# EAGLE design sch2 (EAGLE 7.4.0)
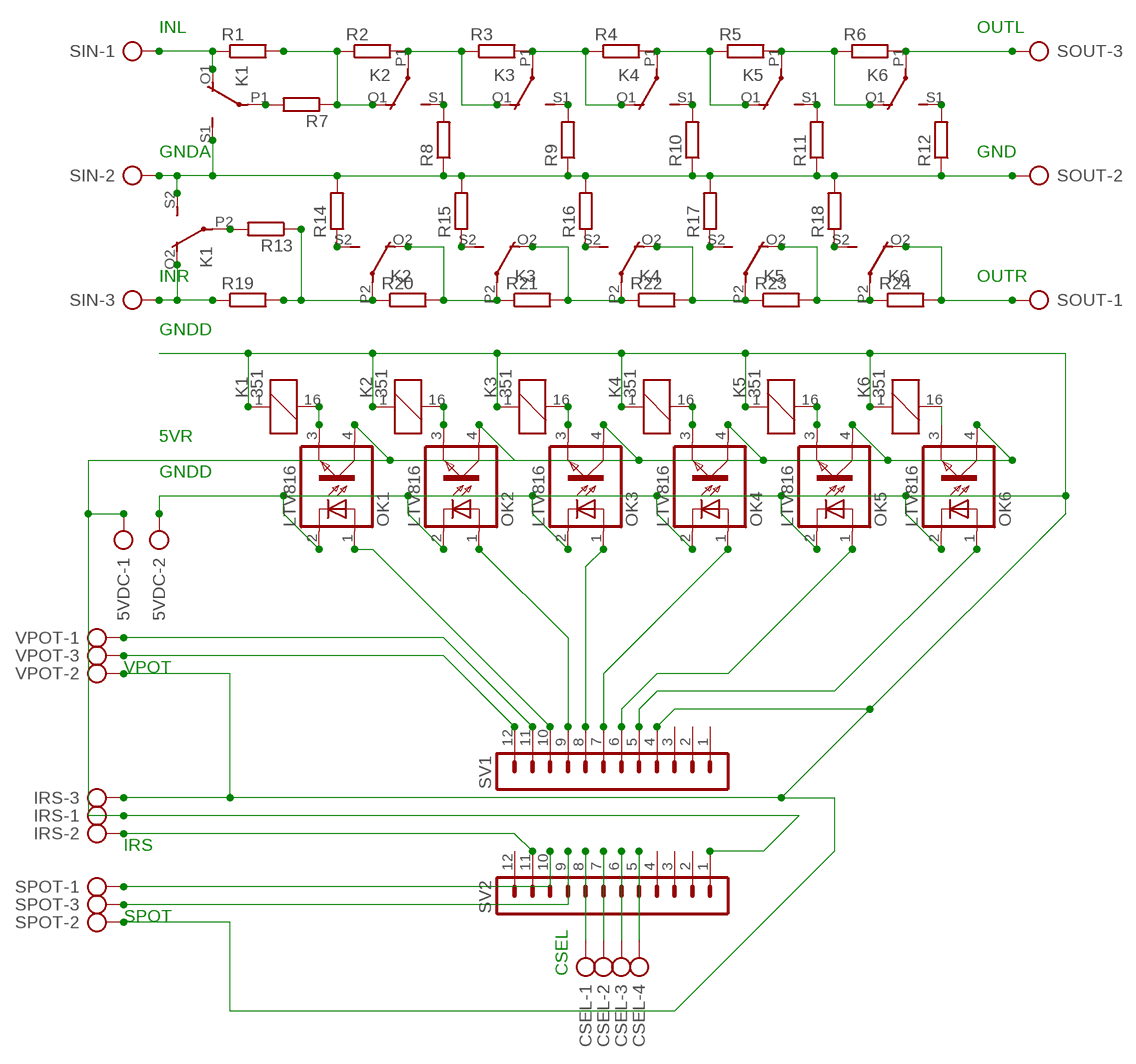
[diagram p0: schematic, sheet 1]

## Parts
5VDC  AK500/2  [AK500/2]
CSEL  AK500/4  [AK500/4]
IRS  AK500/3  [AK500/3]
K1  351  [351]
K2  351  [351]
K3  351  [351]
K4  351  [351]
K5  351  [351]
K6  351  [351]
OK1  LTV816  [DIL04]
OK2  LTV816  [DIL04]
OK3  LTV816  [DIL04]
OK4  LTV816  [DIL04]
OK5  LTV816  [DIL04]
OK6  LTV816  [DIL04]
R1  R-EU_0204/7  [0204/7]
R2  R-EU_0204/7  [0204/7]
R3  R-EU_0204/7  [0204/7]
R4  R-EU_0204/7  [0204/7]
R5  R-EU_0204/7  [0204/7]
R6  R-EU_0204/7  [0204/7]
R7  R-EU_0204/7  [0204/7]
R8  R-EU_0204/7  [0204/7]
R9  R-EU_0204/7  [0204/7]
R10  R-EU_0204/7  [0204/7]
R11  R-EU_0204/7  [0204/7]
R12  R-EU_0204/7  [0204/7]
R13  R-EU_0204/7  [0204/7]
R14  R-EU_0204/7  [0204/7]
R15  R-EU_0204/7  [0204/7]
R16  R-EU_0204/7  [0204/7]
R17  R-EU_0204/7  [0204/7]
R18  R-EU_0204/7  [0204/7]
R19  R-EU_0204/7  [0204/7]
R20  R-EU_0204/7  [0204/7]
R21  R-EU_0204/7  [0204/7]
R22  R-EU_0204/7  [0204/7]
R23  R-EU_0204/7  [0204/7]
R24  R-EU_0204/7  [0204/7]
SIN  AK500/3  [AK500/3]
SOUT  AK500/3  [AK500/3]
SPOT  AK500/3  [AK500/3]
SV1  MA12-1  [MA12-1]
SV2  MA12-1  [MA12-1]
VPOT  AK500/3  [AK500/3]

## Nets
GNDA: K1.S1(2:S) K1.S2(3:S) R8.1 R9.1 R10.1 R11.1 R12.1 R14.2 R15.2 R16.2 R17.2 R18.2 SIN.2 SOUT.2
GNDD: 5VDC.2 IRS.3 K1.1 K2.1 K3.1 K4.1 K5.1 K6.1 OK1.2(C) OK2.2(C) OK3.2(C) OK4.2(C) OK5.2(C) OK6.2(C) SPOT.2 SV1.4 VPOT.2
N$1: K2.O1(2:O) R1.2 R2.1 R7.1
N$2: K2.P1(2:P) K3.O1(2:O) R2.2 R3.1
N$3: K3.P1(2:P) K4.O1(2:O) R3.2 R4.1
N$4: K4.P1(2:P) K5.O1(2:O) R4.2 R5.1
N$5: K5.P1(2:P) K6.O1(2:O) R5.2 R6.1
N$6: K6.P1(2:P) R6.2 SOUT.3
N$7: K1.O1(2:O) R1.1 SIN.1
N$8: K1.P2(3:P) R13.2
N$9: K2.S1(2:S) R8.2
N$10: K3.S1(2:S) R9.2
N$11: K4.S1(2:S) R10.2
N$12: K5.S1(2:S) R11.2
N$13: K6.S1(2:S) R12.2
N$14: K1.P1(2:P) R7.2
N$15: K1.O2(3:O) R19.1 SIN.3
N$16: K2.S2(3:S) R14.1
N$17: K3.S2(3:S) R15.1
N$18: K4.S2(3:S) R16.1
N$19: K5.S2(3:S) R17.1
N$20: K6.S2(3:S) R18.1
N$21: SV1.11 VPOT.1
N$22: SV1.12 VPOT.3
N$23: K1.16 OK1.3(EMIT)
N$24: K2.16 OK2.3(EMIT)
N$25: K3.16 OK3.3(EMIT)
N$26: K4.16 OK4.3(EMIT)
N$27: K2.P2(3:P) R13.1 R19.2 R20.1
N$28: K2.O2(3:O) K3.P2(3:P) R20.2 R21.1
N$29: K3.O2(3:O) K4.P2(3:P) R21.2 R22.1
N$30: K4.O2(3:O) K5.P2(3:P) R22.2 R23.1
N$31: K5.O2(3:O) K6.P2(3:P) R23.2 R24.1
N$32: K6.O2(3:O) R24.2 SOUT.1
N$33: K5.16 OK5.3(EMIT)
N$34: K6.16 OK6.3(EMIT)
N$36: OK6.1(A) SV1.5
N$37: OK5.1(A) SV1.6
N$38: OK4.1(A) SV1.7
N$39: OK3.1(A) SV1.8
N$40: OK2.1(A) SV1.9
N$41: OK1.1(A) SV1.10
N$42: IRS.2 SV2.11
N$43: CSEL.1 SV2.8
N$44: CSEL.2 SV2.7
N$45: CSEL.3 SV2.6
N$46: CSEL.4 SV2.5
N$47: SPOT.1 SV2.10
N$48: SPOT.3 SV2.9
N$50: 5VDC.1 IRS.1 OK1.4(COL) OK2.4(COL) OK3.4(COL) OK4.4(COL) OK5.4(COL) OK6.4(COL) SV2.1
Unconnected: SV1.1 SV1.2 SV1.3 SV2.2 SV2.3 SV2.4 SV2.12

## Notes on the sheet
- INL | OUTL
- GNDA | GND
- INR | OUTR
- GNDD
- 5VR
- GNDD
- VPOT
- IRS
- SPOT
- CSEL

## Library data of the parts
5VDC = con-ptr500:AK500/2: CONNECTOR; OC_FARNELL: unknown; OC_NEWARK: unknown
CSEL = con-ptr500:AK500/4: CONNECTOR; OC_FARNELL: unknown; OC_NEWARK: unknown
IRS SIN SOUT SPOT VPOT = con-ptr500:AK500/3: CONNECTOR; OC_FARNELL: unknown; OC_NEWARK: unknown
K1-K6 = relay:351: RELAY 2 x switch, Omron; OC_FARNELL: unknown; OC_NEWARK: unknown
OK1-OK6 = optocoupler:LTV816: OPTO COUPLER Source: LITEON, LTV816.pdf; OC_FARNELL: unknown; OC_NEWARK: unknown
R1-R24 = rcl:R-EU_: RESISTOR, European symbol
SV1 SV2 = con-lstb:MA12-1: PIN HEADER; OC_FARNELL: unknown; OC_NEWARK: unknown

## Board
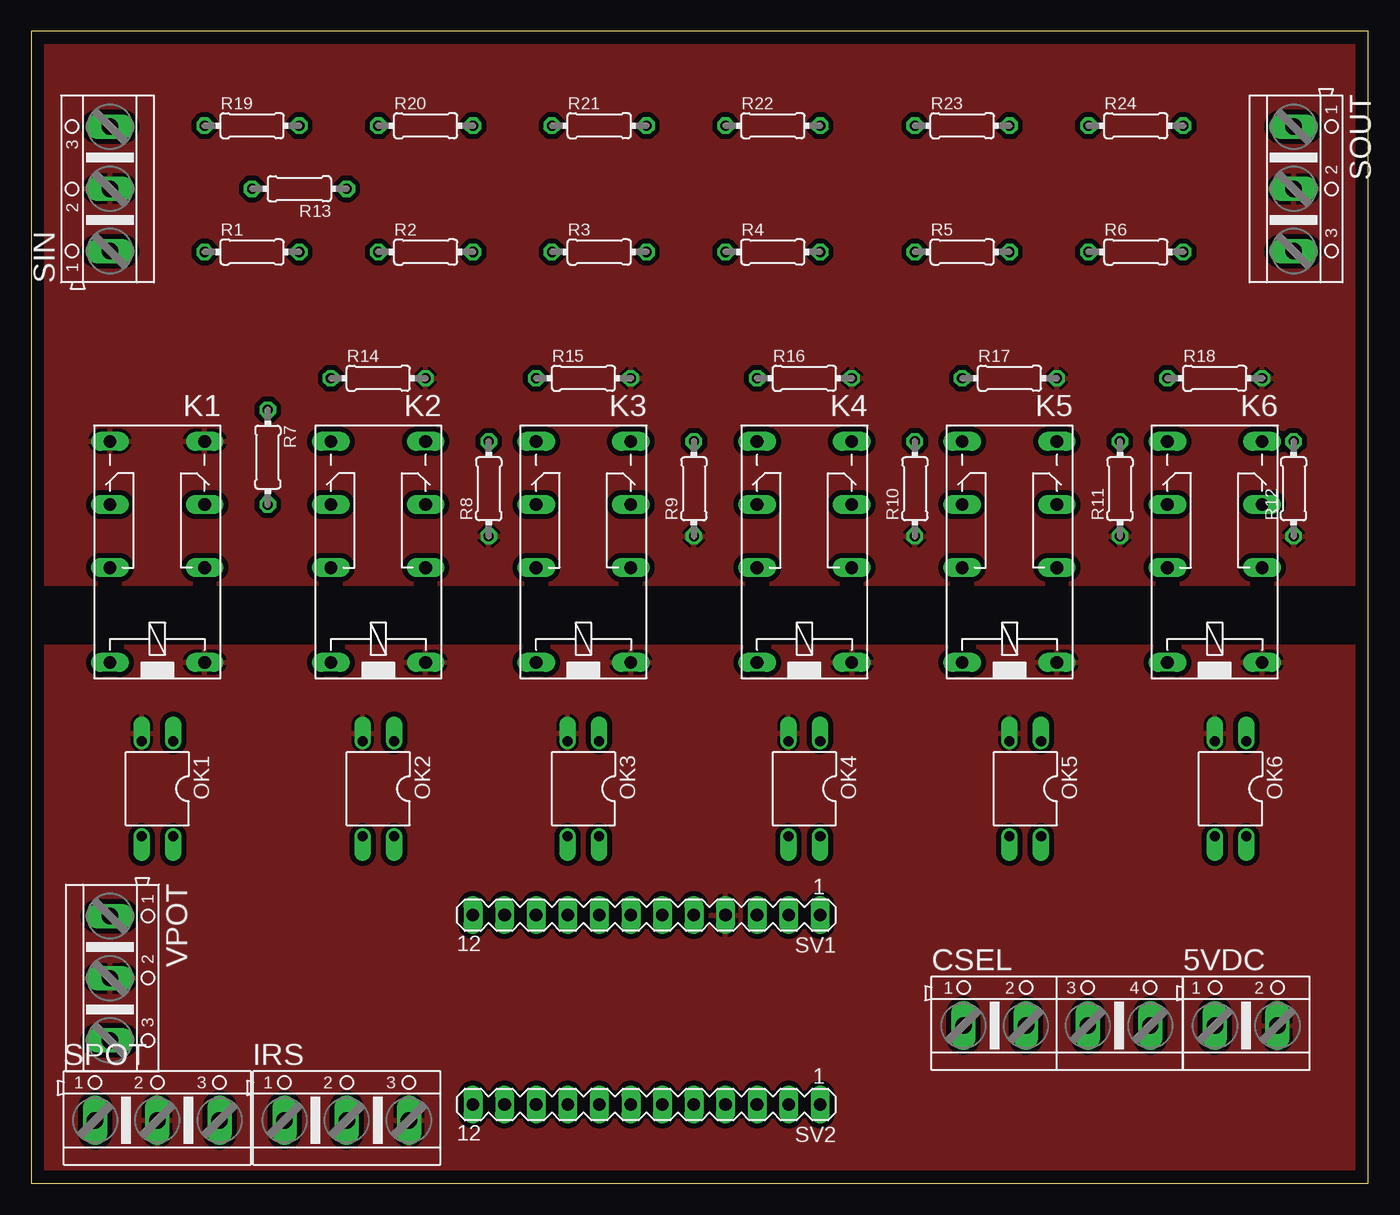
[diagram p1: board, top side]
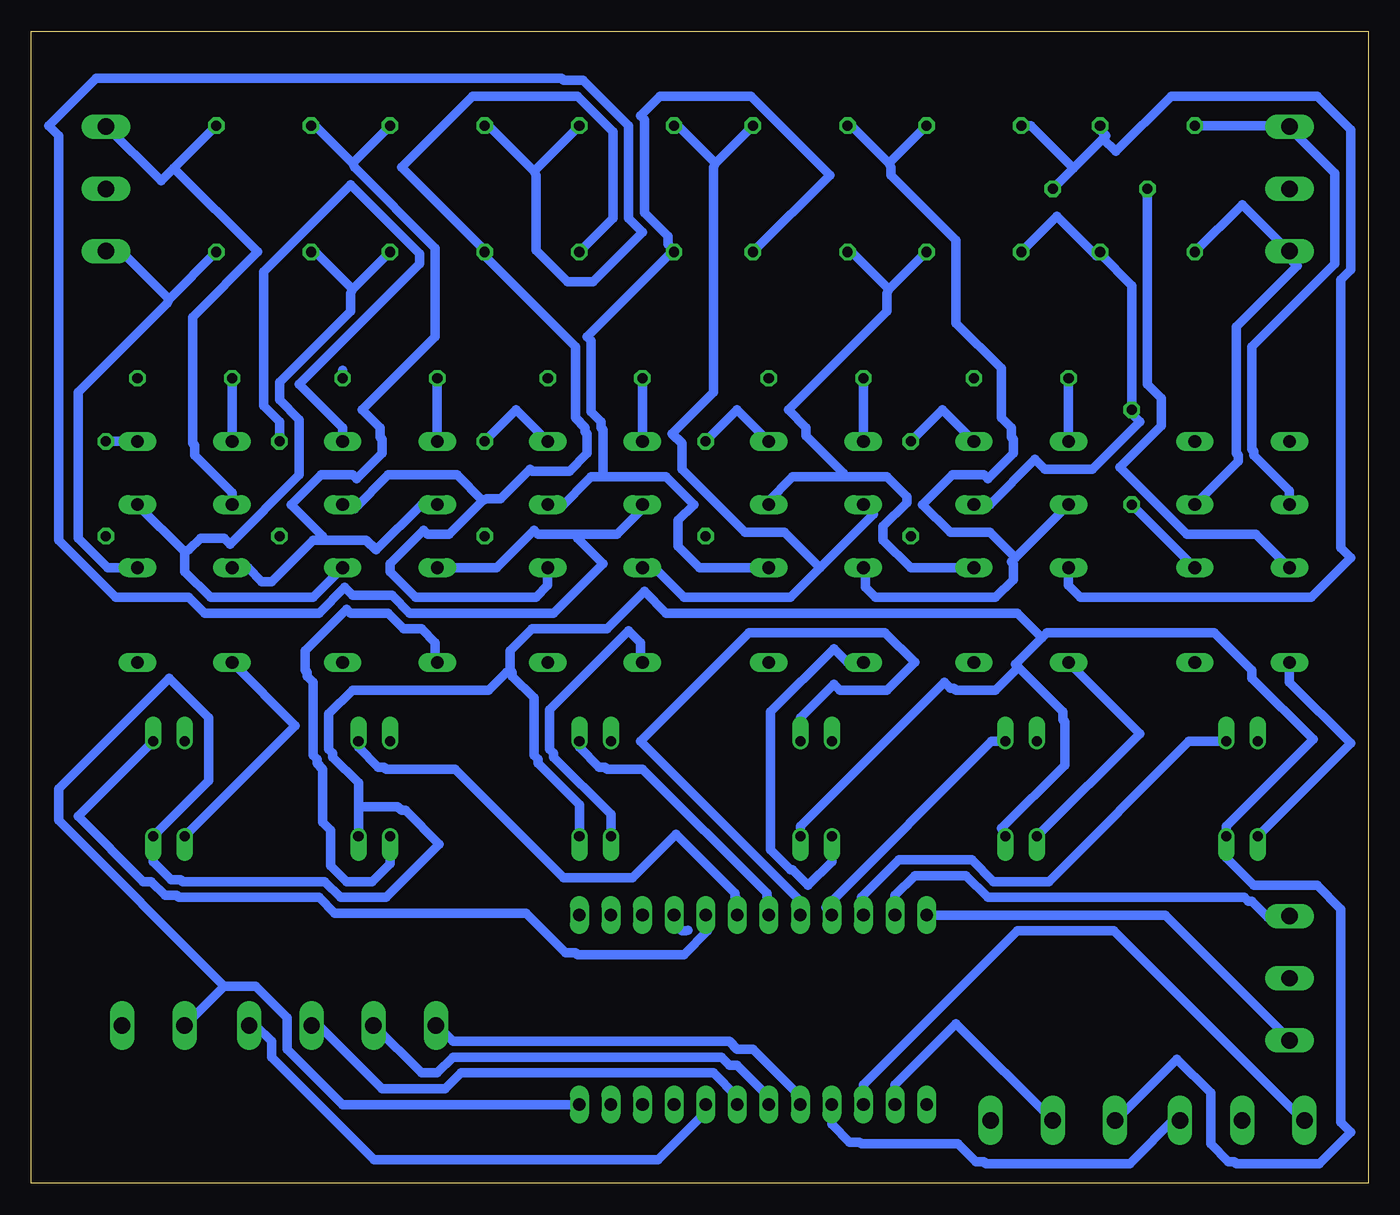
[diagram p2: board, bottom side, seen from below]

Size 107.62 x 92.7 mm. Coordinates in mm from the lower left corner, seen from the top.
Outline: 0,0 107.62,0 107.62,92.7 0,92.7 0,0
Copper layers (1*16): Top 0.035mm / dielectric 1.5mm / Bottom 0.035mm
Design rules "default *": minimum track width 30mil, minimum drill 24mil, track to track 16mil, track to pad 16mil, pad to pad 16mil, via to via 16mil, smd to smd 8mil, copper to edge 40mil, drill to drill 8mil, minimum pad ring 10mil, minimum via ring 8mil, stop-mask expansion 4mil, vias tented up to drill 0mil, thermal gap 10mil

### Footprints (pad centres in the part's own frame; a part is rotated, then mirrored left to right if it is on the bottom)
AK500/2 = drill 1.321 long: 1 -2.515,0; 2 2.515,0
AK500/4 = drill 1.321 long: 1 -7.518,0; 2 -2.489,0; 3 2.489,0; 4 7.518,0
AK500/3 = drill 1.321 long: 1 -5.004,0; 2 0,0; 3 5.004,0
351 = drill 1.016 long: 1 -3.81,-3.81; 16 -3.81,3.81; O1 8.89,-3.81; O2 8.89,3.81; P1 3.81,-3.81; P2 3.81,3.81; S1 13.97,-3.81; S2 13.97,3.81
DIL04 = drill 0.813 offset: 1 -1.27,-3.81; 2 1.27,-3.81; 3 1.27,3.81; 4 -1.27,3.81
0204/7 = drill 0.813 octagon: 1 -3.81,0; 2 3.81,0
MA12-1 = drill 1.016 long: 1 -13.97,0; 2 -11.43,0; 3 -8.89,0; 4 -6.35,0; 5 -3.81,0; 6 -1.27,0; 7 1.27,0; 8 3.81,0; 9 6.35,0; 10 8.89,0; 11 11.43,0; 12 13.97,0

### Placement (x,y rotation side)
5VDC  97.79,12.7 0 top
CSEL  82.55,12.7 0 top
IRS  25.4,5.08 0 top
K1  10.16,45.72 90 top
K2  27.94,45.72 90 top
K3  44.45,45.72 90 top
K4  62.23,45.72 90 top
K5  78.74,45.72 90 top
K6  95.25,45.72 90 top
OK1  10.16,31.75 180 top
OK2  27.94,31.75 180 top
OK3  44.45,31.75 180 top
OK4  62.23,31.75 180 top
OK5  80.01,31.75 180 top
OK6  96.52,31.75 180 top
R1  17.78,74.93 0 top
R2  31.75,74.93 0 top
R3  45.72,74.93 0 top
R4  59.69,74.93 0 top
R5  74.93,74.93 0 top
R6  88.9,74.93 0 top
R7  19.05,58.42 270 top
R8  36.83,55.88 90 top
R9  53.34,55.88 90 top
R10  71.12,55.88 90 top
R11  87.63,55.88 90 top
R12  101.6,55.88 90 top
R13  21.59,80.01 180 top
R14  27.94,64.77 0 top
R15  44.45,64.77 0 top
R16  62.23,64.77 0 top
R17  78.74,64.77 0 top
R18  95.25,64.77 0 top
R19  17.78,85.09 0 top
R20  31.75,85.09 0 top
R21  45.72,85.09 0 top
R22  59.69,85.09 0 top
R23  74.93,85.09 0 top
R24  88.9,85.09 0 top
SIN  6.35,80.01 90 top
SOUT  101.6,80.01 270 top
SPOT  10.16,5.08 0 top
SV1  49.53,21.59 180 top
SV2  49.53,6.35 180 top
VPOT  6.35,16.51 270 top

### Tracks (layer width: path | path; a pad name or v marks a point on that pad's centre or on a via)
GNDA
  Bottom 0.762: 82.55,65.41 R17.2 | R17.2
  pour Top: 0,92.71 107.95,92.71 107.95,48.26 0,48.26
GNDD
  Bottom 0.762: 54.75,20.36 54.93,20.32 55.24,20.32 55.88,20.95 SV1.4 55.83,21.54
  pour Top: 0,43.18 107.95,43.18 107.95,0 0,0
N$1
  Bottom 0.762: R2.1 25.08,77.79 21.91,74.61 R1.2 21.59,74.77 19.05,72.23 R7.1 19.05,61.91 18.41,61.28 22.23,57.47 26.04,57.47 26.83,58.26 30.48,54.61 K2.O1
N$2
  Bottom 0.762: 38.58,71.91 R2.2 | 38.58,71.91 41.59,74.93 R3.1 | K2.P1 36.83,49.53 39.05,51.75 39.05,52.86 37.15,54.77 37.15,55.25 38.73,56.83 42.23,56.83 | 42.23,56.83 46.35,56.83 48.42,54.77 K3.O1 | 38.58,71.91 38.73,71.6 38.73,70.17 46.67,62.23 45.24,60.8 45.24,60.17 42.23,57.15 42.23,56.83
N$3
  Bottom 0.762: R3.2 43.34,81.12 49.69,87.47 56.99,87.47 58.58,85.88 58.26,85.57 58.26,78.11 56.36,76.2 56.36,75.56 55.88,75.09 R4.1 56.2,74.77 62.87,68.1 62.55,67.79 62.55,62.07 61.75,61.28 61.75,60.8 61.59,60.64 61.59,56.83 | K3.P1 53.82,49.53 55.56,51.28 55.56,53.34 54.29,54.61 56.52,56.83 61.59,56.83 | 61.59,56.83 62.55,56.83 65.09,54.29 65.72,54.29 K4.O1
N$4
  Bottom 0.762: K4.P1 66.04,48.1 66.99,47.15 76.68,47.15 78.74,49.21 78.74,49.85 76.04,52.55 75.72,52.23 73.98,52.23 71.28,54.93 | 71.28,54.93 73.34,56.99 78.9,56.99 81.6,54.29 82.23,54.29 K5.O1 | R4.2 60.8,77.63 60.8,84.61 63.66,87.47 72.07,87.47 77.79,81.76 71.12,75.09 R5.1 71.12,74.61 63.82,67.31 63.82,61.59 63.02,60.8 63.02,60.48 62.87,60.33 62.87,58.74 64.29,57.31 67.31,57.31 67.47,57.47 69.85,55.09 70.96,55.09 71.28,54.93
N$5
  Bottom 0.762: 81.76,71.91 R5.2 | 81.76,71.91 84.77,74.93 R6.1 | K5.P1 84.93,47.15 93.19,47.15 95.25,49.21 95.25,50.8 | K6.O1 95.25,50.8 | 81.76,71.91 81.92,71.6 81.92,70.17 87.63,64.45 87.63,63.02 86.04,61.44 86.04,56.99 91.6,51.44 92.08,51.91 93.98,51.91 94.93,50.96 95.25,50.8
N$6
  Bottom 0.762: 96.52,71.12 R6.2 | 96.52,71.12 100.01,74.61 101.28,74.61 101.6,74.93 SOUT.3 | K6.P1 101.44,49.53 103.82,51.91 103.82,63.66 96.68,70.8 96.52,71.12
N$7
  Bottom 0.762: R1.1 10.16,78.74 6.35,74.93 SIN.1 6.51,74.61 5.71,73.82 10.64,68.9 10.64,58.74 10.48,58.58 10.48,58.1 K1.O1
N$8
  Bottom 0.762: R13.2 17.78,64.29 16.67,63.18 16.67,60.96 20,57.63 14.61,52.23 9.05,52.23 K1.P2
N$9
  Bottom 0.762: R8.2 34.29,62.23 K2.S1
N$10
  Bottom 0.762: R9.2 50.8,62.23 K3.S1
N$11
  Bottom 0.762: R10.2 68.58,62.23 K4.S1
N$12
  Bottom 0.762: R11.2 87.63,61.28 88.9,62.55 88.9,73.34 81.92,80.33 76.36,74.77 76.36,73.98 86.04,64.29 82.55,60.8 K5.S1
N$13
  Bottom 0.762: K6.S1 R12.2
N$14
  Bottom 0.762: K1.P1 R7.2
N$15
  Bottom 0.762: R19.1 6.35,85.09 SIN.3 6.19,84.77 2.7,81.28 2.7,73.98 9.37,67.31 9.37,59.05 9.21,58.9 9.21,58.58 6.35,55.72 K1.O2
N$16
  Bottom 0.762: K2.S2 R14.1
N$17
  Bottom 0.762: K3.S2 R15.1
N$18
  Bottom 0.762: K4.S2 R16.1
N$19
  Bottom 0.762: K5.S2 R17.1
N$20
  Bottom 0.762: K6.S2 R18.1
N$21
  Bottom 0.762: SV1.11 38.1,23.18 36.51,24.76 32.38,24.76 30.64,23.02 10,23.02 9.68,22.7 9.37,22.7 8.1,21.43 6.35,21.43 VPOT.1
N$22
  Bottom 0.762: SV1.12 16.35,21.59 6.35,11.59 VPOT.3
N$23
  Bottom 0.762: OK1.3 1.43,35.4 6.35,40.32 K1.16
N$24
  Bottom 0.762: OK2.3 18.41,36.2 K2.16
N$25
  Bottom 0.762: OK3.3 43.18,25.88 45.09,23.97 46.35,25.24 46.51,25.24 48.1,26.83 48.1,37.94 43.02,43.02 41.91,41.91 K3.16
N$26
  Bottom 0.762: OK4.3 60.96,29.69 65.56,34.29 65.56,34.61 65.88,34.92 65.88,38.1 59.53,44.45 58.58,43.5 58.58,42.07 K4.16
N$27
  Bottom 0.762: 21.35,84.06 21.11,84.3 21.59,84.77 R19.2 | 21.35,84.06 23.73,81.68 | 23.73,81.68 R13.1 | R20.1 27.15,85.09 23.73,81.68 | K2.P2 24.13,48.1 23.18,47.15 4.6,47.15 1.43,50.32 2.22,51.12 2.22,72.71 1.43,73.5 1.43,84.77 4.13,87.47 15.88,87.47 20.32,83.03 21.35,84.06
N$28
  Bottom 0.762: 38.58,82.07 R20.2 | 38.58,82.07 41.59,85.09 R21.1 | 28.42,50.32 28.73,50.01 28.57,49.85 28.57,48.58 30,47.15 39.69,47.15 40.48,47.94 40.48,49.37 K3.P2 | 28.42,50.32 K2.O2 | 28.42,50.32 30.48,52.39 33.66,52.39 35.88,54.61 33.5,56.99 30.96,56.99 30.64,56.67 28.57,58.74 28.57,59.85 28.73,60.01 28.73,60.8 29.53,61.59 29.53,65.56 33.18,69.22 33.18,75.88 38.42,81.12 38.42,81.76 38.58,82.07
N$29
  Bottom 0.762: 52.55,82.07 R21.2 | 52.55,82.07 55.56,85.09 R22.1 | K4.P2 57.47,49.53 55.09,47.15 46.51,47.15 44.13,49.53 | 44.13,49.53 39.85,53.82 K3.O2 | 44.13,49.53 46.99,52.39 50.16,52.39 55.24,57.47 55.24,59.53 56.04,60.33 52.7,63.66 52.7,81.76 52.55,82.07
N$30
  Bottom 0.762: 67.15,81.44 R22.2 | 67.15,81.44 70.8,85.09 R23.1 | K5.P2 70.17,49.53 67.15,52.55 66.83,52.23 63.66,52.23 | 63.66,52.23 60.48,52.23 58.26,54.45 K4.O2 | 67.15,81.44 66.99,81.12 66.99,75.09 64.45,72.55 62.39,72.55 58.42,76.52 59.53,77.63 59.53,85.09 63.18,88.74 64.77,88.74 64.93,88.9 102.39,88.9 106.2,85.09 105.41,84.3 105.41,51.75 100.81,47.15 94.93,47.15 93.66,45.88 84.45,45.88 82.39,47.94 81.76,47.31 78.58,47.31 77.15,45.88 65.56,45.88 61.59,49.85 63.66,51.91 63.66,52.23
N$31
  Bottom 0.762: 81.76,82.07 R23.2 | 81.76,82.07 84.77,85.09 R24.1 | K5.O2 76.2,54.61 79.85,50.96 80.64,51.75 84.14,51.75 | 84.14,51.75 84.93,51.75 88.27,48.42 89.06,48.42 90.17,49.53 K6.P2 | 81.76,82.07 81.6,81.76 75.09,75.25 75.09,68.1 80.96,62.23 79.53,60.8 79.53,60.01 79.38,59.85 79.38,58.74 81.44,56.67 81.76,56.99 84.3,56.99 86.68,54.61 84.14,52.07 84.14,51.75
N$32
  Bottom 0.762: 96.12,81.68 97.16,80.64 101.6,85.09 SOUT.1 | 96.12,81.68 R24.2 | K6.O2 91.44,55.56 94.46,58.58 94.46,59.37 94.61,59.53 94.61,69.69 89.38,74.93 96.12,81.68
N$33
  Bottom 0.762: OK5.3 78.74,25.72 80.17,24.29 82.23,24.29 83.5,25.56 83.5,28.42 84.14,29.05 84.14,33.34 84.61,33.81 84.61,34.13 84.93,34.45 84.93,40.32 85.41,40.8 85.41,41.12 85.57,41.28 85.57,42.86 82.23,46.2 81.92,45.88 78.9,45.88 77.63,44.61 76.2,44.61 75.09,43.5 75.09,42.07 K5.16
N$34
  Bottom 0.762: OK6.3 86.36,36.83 K6.16
N$36
  Bottom 0.762: OK6.1 103.82,29.53 98.58,24.29 97.95,24.29 96.84,23.18 95.89,23.18 95.73,23.02 84.45,23.02 83.19,21.75 67.79,21.75 64.61,18.57 63.82,18.57 63.66,18.41 55.09,18.41 53.18,20.32 53.18,21.43 SV1.5
N$37
  Bottom 0.762: OK5.1 81.28,35.08 79.69,33.5 79.22,33.5 79.06,33.34 73.5,33.34 64.77,24.61 59.21,24.61 55.72,28.1 50.96,23.34 50.96,23.02 50.8,22.86 SV1.6
N$38
  Bottom 0.762: OK4.1 63.5,35.08 61.91,33.5 61.44,33.5 61.28,33.34 58.42,33.34 48.42,23.34 48.42,23.02 48.26,22.86 SV1.7
N$39
  Bottom 0.762: OK3.1 45.72,37.47 43.02,40.16 42.55,39.69 38.73,39.69 36.51,41.91 38.89,44.29 49.85,44.29 58.58,35.56 45.72,22.7 SV1.8
N$40
  Bottom 0.762: OK2.1 30.32,35.56 43.66,22.22 43.18,21.75 SV1.9
N$41
  Bottom 0.762: OK1.1 14.45,35.56 25.72,24.29 30.16,24.29 31.91,26.04 37.78,26.04 40.8,23.02 40.64,22.86 SV1.10
N$42
  Bottom 0.762: SV2.11 38.1,7.94 33.18,12.86 IRS.2
N$43
  Bottom 0.762: SV2.8 45.72,6.98 49.53,10.79 50.8,10.79 51.44,11.43 73.66,11.43 74.93,12.7 CSEL.1
N$44
  Bottom 0.762: SV2.7 48.26,6.98 50.8,9.53 51.44,9.53 52.07,10.16 73.66,10.16 74.93,8.89 76.2,8.89 80.01,12.7 CSEL.2
N$45
  Bottom 0.762: SV2.6 50.8,6.98 52.7,8.89 73.03,8.89 74.3,7.62 79.38,7.62 84.45,12.7 CSEL.3
N$46
  Bottom 0.762: SV2.5 53.34,5.71 57.15,1.91 80.01,1.91 88.27,10.16 88.27,11.43 89.53,12.7 CSEL.4
N$47
  Bottom 0.762: SV2.10 40.64,7.94 28.26,20.32 20.48,20.32 5.24,5.08 SPOT.1
N$48
  Bottom 0.762: SV2.9 43.18,4.76 41.75,3.33 40.96,3.33 40.8,3.17 33.02,3.17 31.59,1.75 30.96,1.75 30.8,1.59 19.21,1.59 15.4,5.4 15.08,5.08 SPOT.3
N$50
  Bottom 0.762: 26.27,43.89 28.42,41.75 28.18,41.51 | 26.27,43.89 25.88,44.29 12.38,44.29 9.37,41.28 9.37,40.64 4.45,35.72 11.43,28.73 OK1.4 11.43,26.19 9.21,23.97 4.13,23.97 2.22,22.07 2.22,4.92 1.43,4.13 3.97,1.59 10.64,1.59 10.79,1.75 11.27,1.75 12.7,3.17 12.7,7.3 15.4,10 20.32,5.08 IRS.1 | 28.18,41.51 24.61,37.94 24.61,37.31 24.45,37.15 24.45,33.66 29.53,28.57 29.21,28.26 OK2.4 | OK3.4 45.72,28.73 34.13,40.32 33.66,39.85 33.34,39.85 33.18,39.69 30,39.69 28.18,41.51 | OK4.4 63.5,30.48 66.83,33.81 66.83,34.13 67.15,34.45 67.15,39.05 68.9,40.8 68.9,41.12 69.06,41.28 | 69.06,41.28 69.06,42.86 67.31,44.61 61.28,44.61 58.26,47.62 56.52,45.88 28.26,45.88 26.27,43.89 | 81.28,30.32 81.28,32.23 83.34,34.29 83.34,34.61 83.66,34.92 83.66,37.78 81.76,39.69 70.8,39.69 69.37,41.12 69.06,41.28 | 81.28,30.32 OK5.4 | 81.28,30.32 78.11,30.32 77.79,30 77.47,30 74.77,27.3 79.06,23.02 82.71,23.02 83.98,24.29 95.41,24.29 95.57,24.45 96.36,24.45 97.79,25.88 OK6.4 93.34,32.38 93.34,37.47 96.52,40.64 105.41,31.75 105.41,29.21 92.08,15.88 | SV2.1 82.55,6.35 87,10.79 87,13.34 89.53,15.88 92.08,15.88 | 92.08,15.88 95.25,12.7 5VDC.1